# Altium project power-v2.1.PrjPCB
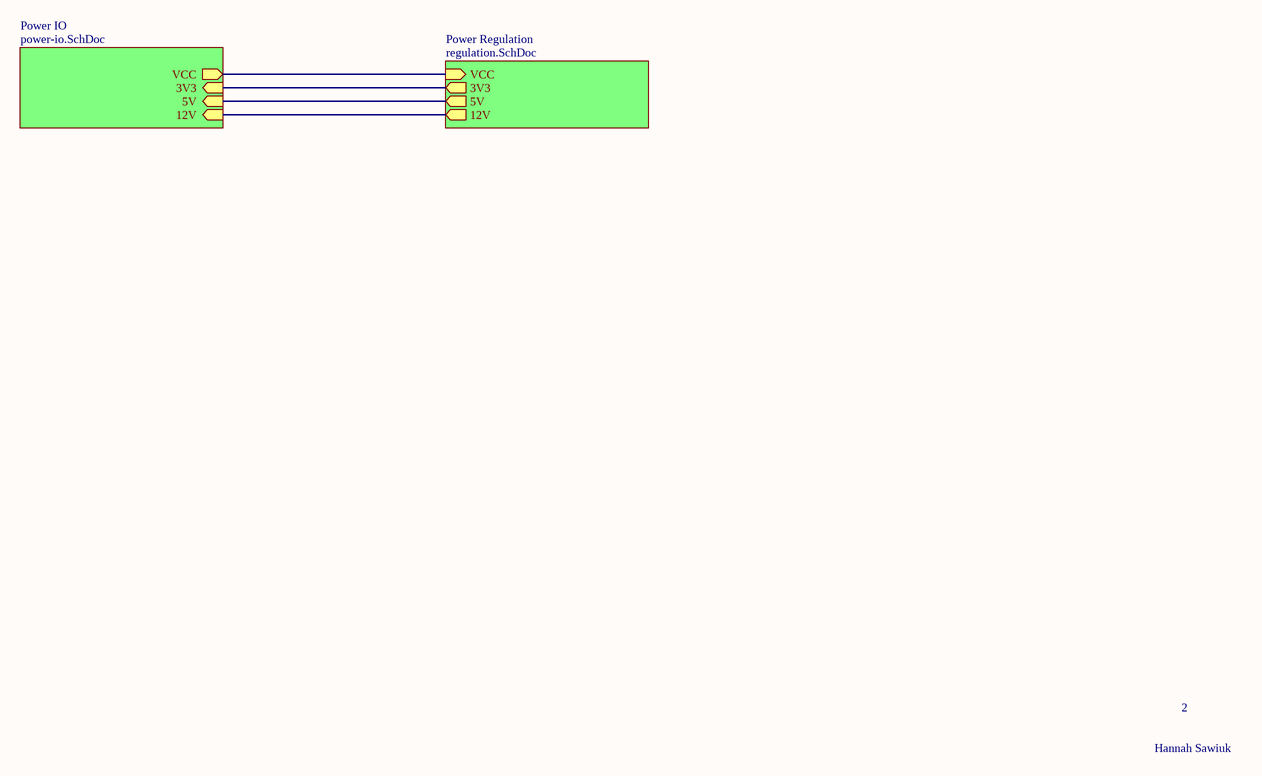
[diagram p0: power-v2.1.SchDoc]
3 sheets, 60 parts. Net scope: hierarchical (ports join the sheet entries above them; power ports are global).
Board file: power-v2.1.PcbDoc
Sheets:
  power-v2.1.SchDoc
    Power IO = power-io.SchDoc
    Power Regulation = regulation.SchDoc

## Sheet power-v2.1.SchDoc
size A4

### Sub-sheets
Power IO = power-io.SchDoc: VCC (out), 3V3 (in), 5V (in), 12V (in)
Power Regulation = regulation.SchDoc: 3V3 (out), 5V (out), 12V (out), VCC (in)

### Nets
3V3: sheet Power IO/3V3, sheet Power Regulation/3V3
5V: sheet Power IO/5V, sheet Power Regulation/5V
12V: sheet Power IO/12V, sheet Power Regulation/12V
NetC3_2: sheet Power IO/VCC, sheet Power Regulation/VCC

### Notes on the sheet
- 2
- Hannah Sawiuk

## Sheet power-io.SchDoc
size A4
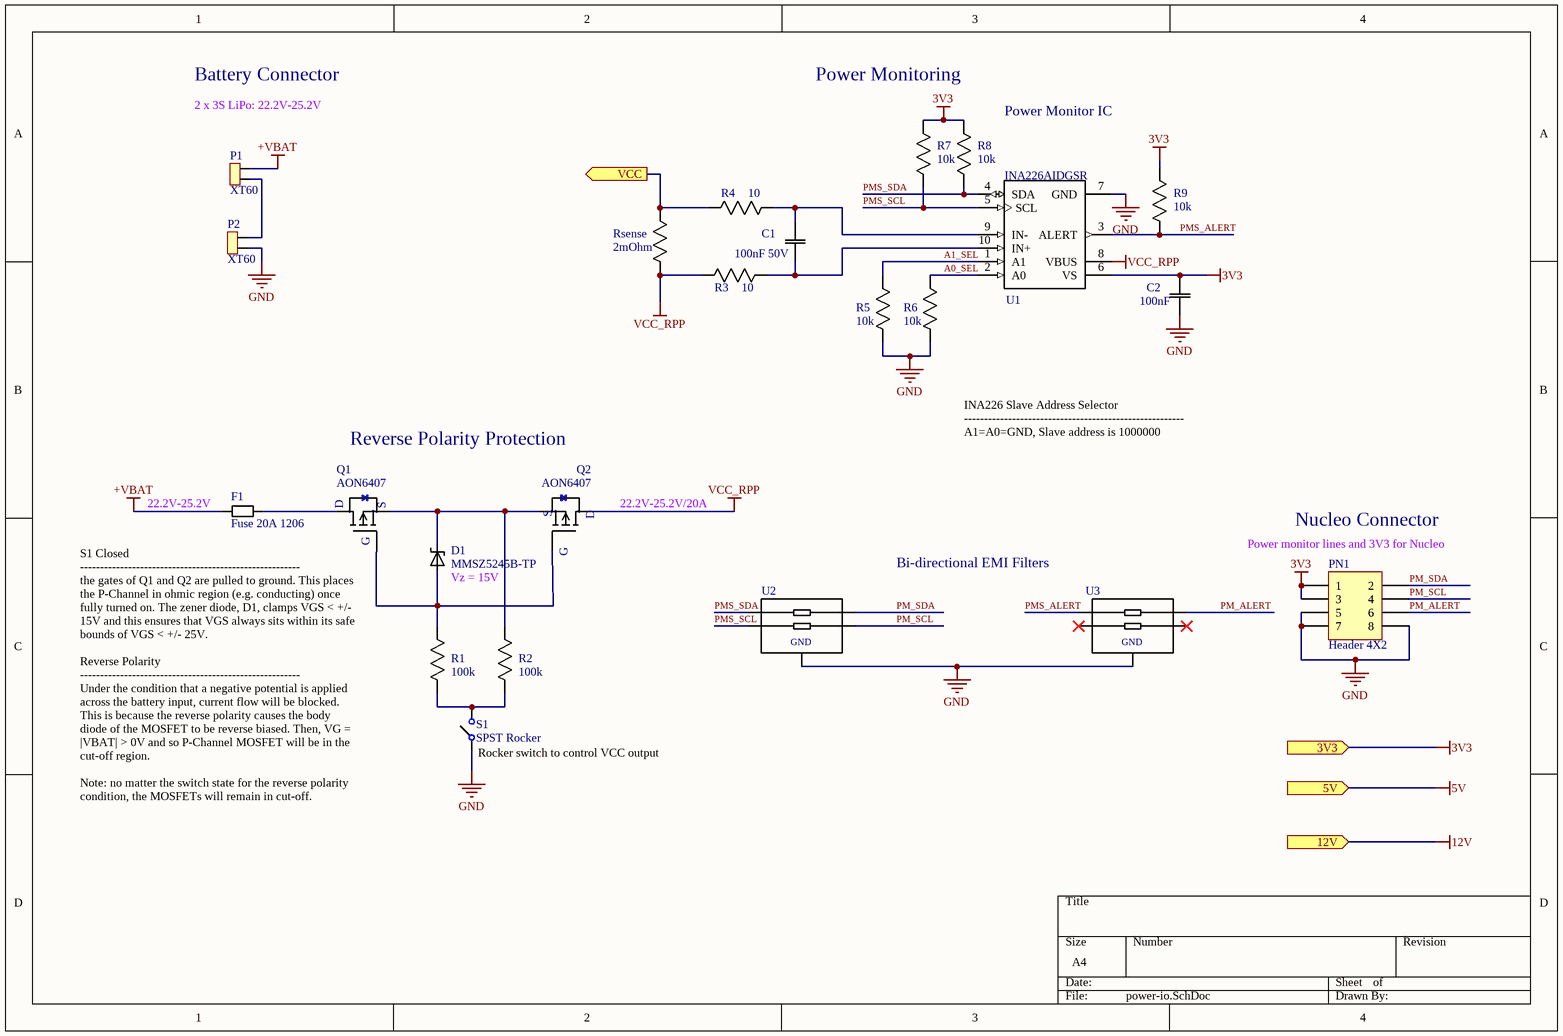
[diagram p1: power-io.SchDoc]

### Parts
C1  100nF 50V  [0805]
C2  100nF  [0805]
D1  MMSZ5245B-TP  [SOD-123]
F1  Fuse 20A 1206  [1206]
P1  XT60  [XT60Connector]
P2  XT60  [XT60Connector]
PN1  Header 4X2  [HDR2X4]
Q1  AON6407  [8-PowerSMD]
Q2  AON6407  [8-PowerSMD]
R1  100k  [0805]
R2  100k  [0805]
R3  10  [0805]
R4  10  [0805]
R5  10k  [0805]
R6  10k  [0805]
R7  10k  [0805]
R8  10k  [0805]
R9  10k  [0805]
Rsense  2mOhm  [1206]
S1  SPST Rocker  [SWITCH ROCKER SPST 10A 125V]
U1  INA226AIDGSR  [10-VSSOP]
U2  EMI  [SOT-665]  (value not drawn)
U3  EMI  [SOT-665]  (value not drawn)

### Ports
3V3 (in), 5V (in), 12V (in), VCC (out)

### Nets
3V3: C2.2(C2) PN1.1 PN1.3 R7.1(R1) R8.1(R1) R9.1(R1) U1.6(VS) ; port 3V3
+VBAT: F1.1 P1.2
GND: C2.1(C1) P2.1 PN1.5 PN1.7 PN1.8 R5.2(R2) R6.2(R2) S1.0 U1.7(GND) U2.2(P$2) U3.2(P$2)
VCC_RPP: Q2.D R3.2(R2) Rsense.2(R2) U1.8(VBUS)
A0_SEL: R6.1(R1) U1.2(A0)
A1_SEL: R5.1(R1) U1.1(A1)
PM_ALERT: PN1.6 U3.5(P$5)
PM_SCL: PN1.4 U2.4(P$4)
PM_SDA: PN1.2 U2.5(P$5)
PMS_ALERT: R9.2(R2) U1.3(ALERT) U3.1(P$1)
PMS_SCL: R7.2(R2) U1.5(SCL) U2.3(P$3)
PMS_SDA: R8.2(R2) U1.4(SDA) U2.1(P$1)
NetC1_1: C1.1(C1) R3.1(R1) U1.10(IN+)
NetC1_2: C1.2(C2) R4.1(R1) U1.9(IN-)
NetC3_2: R4.2(R2) Rsense.1(R1) ; port VCC
NetD1_A: D1.A Q1.G Q2.G R1.1(R1)
NetD1_C: D1.C Q1.S Q2.S R2.1(R1)
NetF1_2: F1.2 Q1.D
NetP1_1: P1.1 P2.2
NetR1_2: R1.2(R2) R2.2(R2) S1.1

Not connected (* = marked no-connect by the designer): U3 3(P$3)* 4(P$4)*

### Notes on the sheet
- Battery Connector
- 2 x 3S LiPo: 22.2V-25.2V
- Power Monitoring
- (near R8) Power Monitor IC
- Reverse Polarity Protection
- (near F1) 22.2V-25.2V
- (near Q2) 22.2V-25.2V/20A
- INA226 Slave Address Selector
  -------------------------------------------------------
  A1=A0=GND, Slave address is 1000000
- (near D1) Vz = 15V
- (near U3) Bi-directional EMI Filters
- (near PN1) Power monitor lines and 3V3 for Nucleo
- Nucleo Connector
- (near S1) Rocker switch to control VCC output
- (near Q1) S1 Closed
  -------------------------------------------------------
  the gates of Q1 and Q2 are pulled to ground. This places the P-Channel in ohmic region (e.g. conducting) once fully turned on. The zener diode, D1, clamps VGS < +/- 15V and this ensures that VGS always sits within its safe bounds of VGS < +/- 25V.
  Reverse Polarity
  -------------------------------------------------------
  Under the condition that a negative potential is applied across the battery input, current flow will be blocked. This is because the reverse polarity causes the body diode of the MOSFET to be reverse biased. Then, VG = |VBAT| > 0V and so P-Channel MOSFET will be in the cut-off region.
  Note: no matter the switch state for the reverse polarity condition, the MOSFETs will remain in cut-off.
- (in symbol IP4256CZ5-W) GND

### Library data of the parts
C1 C2 = CAP 100nF 0805: CAP CER 0.1UF 50V X7R 0805; MP: CC0805KRX7R9BB104; MF: Yageo; Tolerance: 10%; Package: 0805; Price: 0,119 CAD; Value: 100nF; Digikey: 311-1140-1-ND; Digikey Link: https://www.digikey.ca/products/en?keywords=311-1140-1-ND; Rating: 50V
D1 = MMSZ5245B-TP: Zener Diode 15V 500mW ±5% Surface Mount SOD-123; MP: MMSZ5224BT1G; MF: ON Semiconductor; Price: None; SnapEDA_Link: https://www.snapeda.com/parts/MMSZ5224BT1G/ON%20Semiconductor/view-part/230941/?ref=snap; Package: SOD-123 ON Semiconductor; Availability: Unavailable; Value: *; ComponentLink1Description: digikey; ComponentLink1URL: https://www.digikey.ca/en/products/detail/micro-commercial-co/MMSZ5245B-TP/1793206
F1 = Fuse 20A 1206: FUSE BOARD MOUNT 20A 32VAC 63VDC; MF: Schurter Inc.; MP: 3413.0331.22; Digikey: 486-1689-6-ND; Rating: 20A; Digikey Link: https://www.digikey.ca/product-detail/en/schurter-inc/3413.0331.22/486-1689-6-ND/2870024
P1 P2 = XT60 Connector: XT60 CONNECTORS FEMALE PAIR; MF: SparkFun Electronics; MP: PRT-10474; Digikey: 1568-1816-ND; Digikey Link: https://www.digikey.ca/product-detail/en/sparkfun-electronics/PRT-10474/1568-1816-ND/8258064; Package: XT60; Price: 2.13000 CAD; Value: N/A
PN1 = Header 4X2: Header, 4-Pin, Dual row; LatestRevisionDate: 17-Jul-2002; LatestRevisionNote: Re-released for DXP Platform.; Publisher: Altium Limited
Q1 Q2 = AON6407: P-Channel 30V 32A (Ta), 85A (Tc) 7.3W (Ta), 83W (Tc) Surface Mount 8-DFN (5x6); MF: Alpha & Omega Semiconductor Inc.; Package: 8-PowerSMD; MP: AON6407; Digikey: 785-1421-1-ND; Digikey Link: https://www.digikey.ca/product-detail/en/alpha-omega-semiconductor-inc/AON6407/785-1421-1-ND/3466800
R1 R2 = RES 100k 0805: RES SMD 100K OHM 1% 1/8W 0805; MP: RC0805FR-07100KL; MF: Yageo; Rating: 0.125W; Digikey: 311-100KCRCT-ND; Price: 0.058 CAD; Package: 0805; Value: 100k; Digikey Link: https://www.digikey.ca/products/en?keywords=311-100KCRCT-ND; Tolerance: 1%
R3 R4 = RES 10 0805: RES SMD 10 OHM 1% 1/8W 0805; MP: RC0805FR-0710RL; MF: Yageo; Rating: 0.125W; Digikey: 311-10.0CRCT-ND; Price: 0.15 CAD; Package: 0805; Value: 10; Digikey Link: https://www.digikey.ca/product-detail/en/yageo/RC0805FR-0710RL/311-10.0CRCT-ND/730481; Tolerance: 1%
R5 R6 = RES 10k 1/8W: RES SMD 10K OHM 1% 1/8W 0805; Power (Watts): 0.125W; Package: 0805; Value: 10k; Tolerance: 1%
R7-R9 = RES 10k 0805: RES SMD 10K OHM 1% 1/8W 0805; MP: RC0805FR-0710KL; MF: Yageo; Rating: 0.125W; Digikey: 311-10.0KCRCT-ND; Price: 0.061 CAD; Package: 0805; Value: 10k; Digikey Link: https://www.digikey.ca/products/en?keywords=311-10.0KCRCT-ND; Tolerance: 1%
Rsense = RES 2mOhm 1206: RES 0.002 OHM 1% 1W 1206; MP: CSR1206-0R002F1; MF: Riedon; Value: 0.002; Rating: 0.125W; Digikey: 696-1370-1-ND; Price: 0.88 CAD; Package: 1206; Digikey Link: https://www.digikey.ca/product-detail/en/riedon/CSR1206-0R002F1/696-1370-1-ND/2813303
S1 = SWITCH ROCKER SPST 10A 125V: Rocker Switch SPST 10A (AC) 125V Panel Mount, Snap-In; MP: SRB22A2FBBNN; MF: ZF Electronics; Digikey: CH755-ND; Digikey Link: https://www.digikey.ca/product-detail/en/zf-electronics/SRB22A2FBBNN/CH755-ND/446021; Price: 1.276 CAD; Rating: 10A 125V
U1 = INA226AIDGSR: 36-V, Bi-Directional, Ultra-High Accuracy, Low-/High-Side, I2C Out Current/Power Monitor w/ Alert 10-VSSOP -40 to 125; MF: Texas Instruments; Price: None; MP: INA226AIDGSR; SnapEDA_Link: https://www.snapeda.com/parts/INA226AIDGSR/Texas%20Instruments/view-part/53552/?ref=snap; Package: MSOP-10 Texas Instruments; Availability: Unavailable; Value: *; Digikey: 296-29034-2-ND; Digikey Link: https://www.digikey.ca/product-detail/en/texas-instruments/INA226AIDGSR/296-29034-2-ND/2687236
U2 U3 = IP4256CZ5-W: RC (Pi) EMI Filter 2nd Order Low Pass 2 Channel R = 100Ohms, C = 19pF (Total)  SOT-665; MF: Nexperia USA Inc.; MP: IP4256CZ5-W,115; SnapEDA_Link: https://www.snapeda.com/parts/IP4256CZ5-W/Nexperia%20USA%20Inc./view-part/3605439/?ref=snap; Price: 0.17 CAD; Package: SOT-665; Digikey: 1727-4718-1-ND; Digikey Link: https://www.digikey.ca/product-detail/en/nexperia-usa-inc/IP4256CZ5-W115/1727-4718-1-ND/2531158

## Sheet regulation.SchDoc
size A4
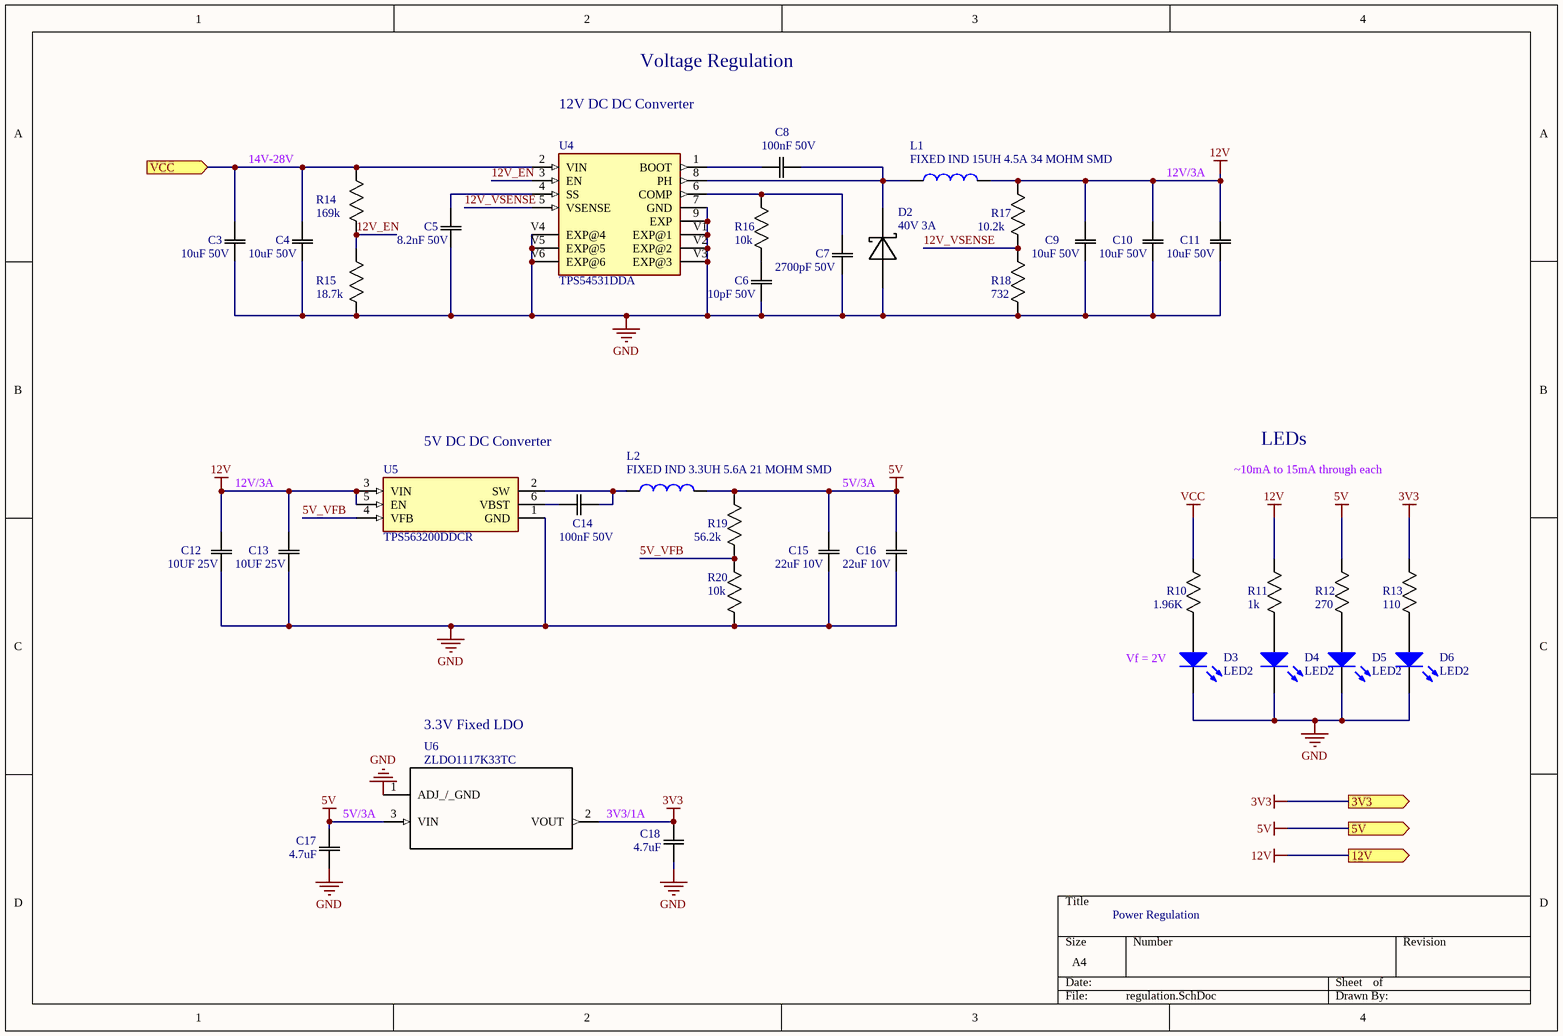
[diagram p2: regulation.SchDoc]

### Parts
C3  10uF 50V  [1210]
C4  10uF 50V  [1210]
C5  8.2nF 50V  [0805]
C6  10pF 50V  [0603]
C7  2700pF 50V  [0805]
C8  100nF 50V  [0805]
C9  10uF 50V  [1210]
C10  10uF 50V  [1210]
C11  10uF 50V  [1210]
C12  10UF 25V  [1206]
C13  10UF 25V  [1206]
C14  100nF 50V  [0805]
C15  22uF 10V  [0805]
C16  22uF 10V  [0805]
C17  4.7uF  [0805]
C18  4.7uF  [0805]
D2  40V 3A  [DO-214AC]
D3  LED2  [3.2X1.6X1.1]
D4  LED2  [3.2X1.6X1.1]
D5  LED2  [3.2X1.6X1.1]
D6  LED2  [3.2X1.6X1.1]
L1  FIXED IND 15UH 4.5A 34 MOHM SMD
L2  FIXED IND 3.3UH 5.6A 21 MOHM SMD
R10  1.96K  [0805]
R11  1k  [0805]
R12  270  [0805]
R13  110  [0805]
R14  169k  [0805]
R15  18.7k  [1206]
R16  10k  [0805]
R17  10.2k  [0805]
R18  732  [0805]
R19  56.2k  [0603]
R20  10k  [0805]
U4  TPS54531DDA  [8-PowerSOIC]
U5  TPS563200DDCR  [TSOT-23-6]
U6  ZLDO1117K33TC  [TO-252-3]

### Ports
3V3 (out), 5V (out), 12V (out), VCC (in)

### Nets
3V3: C18.2(C2) R13.1(R1) U6.2(VOUT) ; port 3V3
5V: C15.2(C2) C16.2(C2) C17.2(C2) L2.2 R12.1(R1) R19.1(R1) U6.3(VIN) ; port 5V
12V: C9.2(C2) C10.2(C2) C11.2(C2) C12.2(C2) C13.2(C2) L1.2 R11.1(R1) R17.2(R2) U5.3(VIN) U5.5(EN) ; port 12V
GND: C3.1(C1) C4.1(C1) C5.1(C1) C6.1(C1) C7.1(C1) C9.1(C1) C10.1(C1) C11.1(C1) C12.1(C1) C13.1(C1) C15.1(C1) C16.1(C1) C17.1(C1) C18.1(C1) D2.A D3.2(K) D4.2(K) D5.2(K) D6.2(K) R15.2(R2) R18.1(R1) R20.1(R1) U4.7(GND) U4.9(EXP) U4.V1(EXP@1) U4.V2(EXP@2) U4.V3(EXP@3) U4.V4(EXP@4) U4.V5(EXP@5) U4.V6(EXP@6) U5.1(GND) U6.1(ADJ_/_GND)
VCC: R10.1(R1)
5V_VFB: R19.2(R2) R20.2(R2) U5.4(VFB)
12V_EN: R14.2(R2) R15.1(R1) U4.3(EN)
12V_VSENSE: R17.1(R1) R18.2(R2) U4.5(VSENSE)
NetC3_2: C3.2(C2) C4.2(C2) R14.1(R1) U4.2(VIN) ; port VCC
NetC5_2: C5.2(C2) U4.4(SS)
NetC6_2: C6.2(C2) R16.2(R2)
NetC7_2: C7.2(C2) R16.1(R1) U4.6(COMP)
NetC8_1: C8.1(C1) U4.1(BOOT)
NetC8_2: C8.2(C2) D2.C(K) L1.1 U4.8(PH)
NetC14_1: C14.1(C1) U5.6(VBST)
NetC14_2: C14.2(C2) L2.1 U5.2(SW)
NetD3_1: D3.1(A) R10.2(R2)
NetD4_1: D4.1(A) R11.2(R2)
NetD5_1: D5.1(A) R12.2(R2)
NetD6_1: D6.1(A) R13.2(R2)

### Notes on the sheet
- 12V DC DC Converter
- Voltage Regulation
- 14V-28V
- 12V/3A
- 5V DC DC Converter
- LEDs
- 5V/3A
- ~10mA to 15mA through each
- (near D3) Vf = 2V
- 3.3V Fixed LDO
- 3V3/1A
- Power Regulation

### Library data of the parts
C3 C4 C9-C11 = CAP 10uF 50V: CAP CER 10UF 50V X7R; Tolerance: 10%; Package: 1210; Value: 10uF; Rating: 50V; ComponentLink1Description: digikey; ComponentLink1URL: https://www.digikey.ca/en/products/detail/kemet/C1210C106M5RACTU/4918883
C5 = CAP 8.2nF 50V: CAP CER 8200PF 50V X7R 0805; Tolerance: 10%; Package: 0805; Value: 8.2nF; Rating: 50V; Temperature Coefficient: X7R; Operating Temperature: -55°C ~ 125°C
C6 = CAP 10pF 50V: CAP CER 10PF 50V X7R 0603; Tolerance: 10%; Package: 0603; Value: 10pF; Rating: 50V; ComponentLink1Description: digikey; ComponentLink1URL: https://www.digikey.ca/en/products/detail/kemet/C0603C100K5RAC7867/8572397
C7 = CAP 2700pF 50V: CAP CER 2700PF 50V X7R 0805; Tolerance: 10%; Package: 0805; Value: 2700pF; Rating: 50V; Temperature Coefficient: X7R; Operating Temperature: -55°C ~ 125°C
C8 C14 = CAP 100nF 50V: CAP CER 0.1UF 50V X7R 0805; Tolerance: 10%; Package: 0805; Value: 100nF; Rating: 50V
C12 C13 = CAP 10uF 25V: CAP CER 10UF 25V X5R 1206; Tolerance: 10%; Package: 1206; Value: 10uF; Rating: 25V; Temperature Coefficient: X5R; Operating Temperature: -55°C ~ 85°C
C15 C16 = CAP 22uF 10V: CAP CER 2.2UF 10V X5R 0805; Tolerance: 20%; Package: 0805; Value: 22uF; Rating: 10V; Temperature Coefficient: X5R; Operating Temperature: -55°C ~ 85°C
C17 C18 = CAP 4.7uF 0805: CAP CER 4.7UF 25V X5R 0805; MP: CL21B475KOFNNNE; MF: Samsung Electro-Mechanics; Tolerance: 10%; Rating: 16V; Temperature Coefficient: X7R; Package: 0805; Price: 0,49 CAD; Value: 4.7uF; Digikey: 1276-2873-1-ND; Digikey Link: https://www.digikey.ca/product-detail/en/samsung-electro-mechanics/CL21B475KOFNNNE/1276-2873-1-ND/3890959
D2 = DIODE SCHOTTKY 40V 3A: Diode Schottky 40V 3A Surface Mount SMA; Voltage - Forward (Vf) (Max) @ If: 450mV @ 3A; ComponentLink1Description: digikey; ComponentLink1URL: https://www.digikey.ca/product-detail/en/on-semiconductor/MBR0540T1G/MBR0540T1GOSCT-ND/917967; Voltage - DC Reverse (Vr) (Max): 40V; Package: DO-214AC; Current - Average Rectified (Io): 3A
D3-D6 = LED GREEN SMD: Typical RED, GREEN, YELLOW, AMBER GaAs LED; Voltage - Forward (Vf) (Typ): 2V; Lens Transparency: Clear; Current - Test: 20mA; Package: 1206; Color: Green
L1 = SDR1307-150ML: 15µH Unshielded Wirewound Inductor 4.5A 34mOhm Max Nonstandard; MF: Bourns Inc.; Inductance: 15.0uH; Current - Saturation: 7.5A; MP: SDR1307-150ML; Height - Seated (Max): 0.287"" (7.30mm); ComponentLink1Description: digikey; ComponentLink1URL: https://www.digikey.ca/en/products/detail/bourns-inc/SRU1048-8R2Y/2352912; Digikey: SDR1307-150MLCT-ND; Digikey Link: https://www.digikey.ca/en/products/detail/bourns-inc/SDR1307-150ML/2561929; DC Resistance (DCR): 34mOhm; Operating Temperature: -40°C ~ 125°C; Size / Dimension: 0.512"" L x 0.512"" W (13.00mm x 13.00mm)
L2 = SRN8040-3R3Y: 3.3µH Semi-Shielded Wirewound Inductor 5.6A 21mOhm Max Nonstandard; MF: Bourns Inc.; MP: SRN8040-3R3Y; Price: None; Package: Nonstandard; Inductance: 3.3uH; ComponentLink1Description: digikey; ComponentLink1URL: https://www.digikey.ca/en/products/detail/bourns-inc/SRU1048-8R2Y/2352912; Digikey: SRN8040-3R3YCT-ND; Digikey Link: https://www.digikey.ca/en/products/detail/bourns-inc/SRN8040-3R3Y/2756131
R10 = RES 1.96k 1/8W: RES SMD 1.96K OHM 1% 1/8W 0805; Power (Watts): 0.125W; Package: 0805; Value: 1.96k; Tolerance: 1%
R11 = RES 1k 1/8W: RES SMD 1K OHM 5% 1/8W 0805; Power (Watts): 0.125W; Package: 0805; Value: 1k; Tolerance: 5%
R12 = RES 270 1/8W: RES SMD 270 OHM 5% 1/8W 0805; Power (Watts): 0.125W; Package: 0805; Value: 270; Tolerance: 5%
R13 = RES 110 1/8W: RES SMD 110 OHM 1% 1/8W 0805; Power (Watts): 0.125W; Package: 0805; Value: 110; Tolerance: 1%
R14 = RES 169k 1/8W: RES SMD 169K OHM 1% 1/8W 0805; Power (Watts): 0.125W; Package: 0805; Value: 169k; Tolerance: 1%; ComponentLink1Description: digikey; ComponentLink1URL: https://www.digikey.ca/en/products/detail/yageo/RC0805FR-07169KL/727634
R15 = RES 18.7K OHM 1/8W: RES SMD 18.7K OHM 1% 1/8W; Power (Watts): 0.125W; Value: 18.7k; Tolerance: 1%; Package: 0805; Alternative Package: 1206
R16 R20 = RES 10k 1/8W: as R5 on sheet power-io; Package: 0805; Value: 10k; Tolerance: 1%
R17 = RES 10.2k 1/8W: RES SMD 10.2K OHM 1% 1/8W 0805; Power (Watts): 0.125W; Package: 0805; Value: 10.2k; Tolerance: 1%; ComponentLink1Description: digikey; ComponentLink1URL: https://www.digikey.ca/en/products/detail/panasonic-electronic-components/ERJ-6ENF1022V/111476
R18 = RES 732 1/8W: RES SMD 732 OHM 1% 1/8W 0805; Power (Watts): 0.125W; Package: 0805; Value: 732; Tolerance: 1%
R19 = RES 56.2k 1/10W: RES SMD 56.2K OHM 1% 1/10W 0603; Power (Watts): 0.1W; Package: 0603; Value: 56.2k; Tolerance: 1%
U4 = TPS54531DDA: Buck Switching Regulator IC Positive Adjustable 0.8V 1 Output 5A 8-PowerSOIC _0.154, 3.90mm Width_; MF: Texas Instruments; Value: *; Price: None; Package: SO-8 Texas Instruments; SnapEDA_Link: https://www.snapeda.com/parts/TPS54531DDA/Texas%20Instruments/view-part/289535/?ref=snap; Availability: Unavailable; MP: TPS54531DDA
U5 = TPS563200DDCR: Buck Switching Regulator IC Positive Adjustable 0.76V 1 Output 3A SOT-23-6 Thin, TSOT-23-6; MF: Texas Instruments; Package: TSOT-23 Texas Instruments; Value: *; Price: None; MP: TPS563200DDCR; SnapEDA_Link: https://www.snapeda.com/parts/TPS563200DDCR/Texas%20Instruments/view-part/71685/?ref=snap; Availability: Unavailable
U6 = ZLDO1117K33TC: Linear Voltage Regulator IC Positive Fixed 1 Output  1A TO-252-3; MF: Diodes Incorporated; Package: TO-252-3; MP: ZLDO1117K33TC; Digikey: ZLDO1117K33DIDKR-ND; Digikey Link: https://www.digikey.ca/product-detail/en/diodes-incorporated/ZLDO1117K33TC/ZLDO1117K33DIDKR-ND/2095639

## Nets that join several sheets
3V3: power-io (7 pins), regulation (C18.2 R13.1 U6.2)
GND: power-io (11 pins), regulation (32 pins)
NetC3_2: power-io (R4.2 Rsense.1), regulation (C3.2 C4.2 R14.1 U4.2)